# EAGLE design hev-controller 1.1 (EAGLE 6.2)
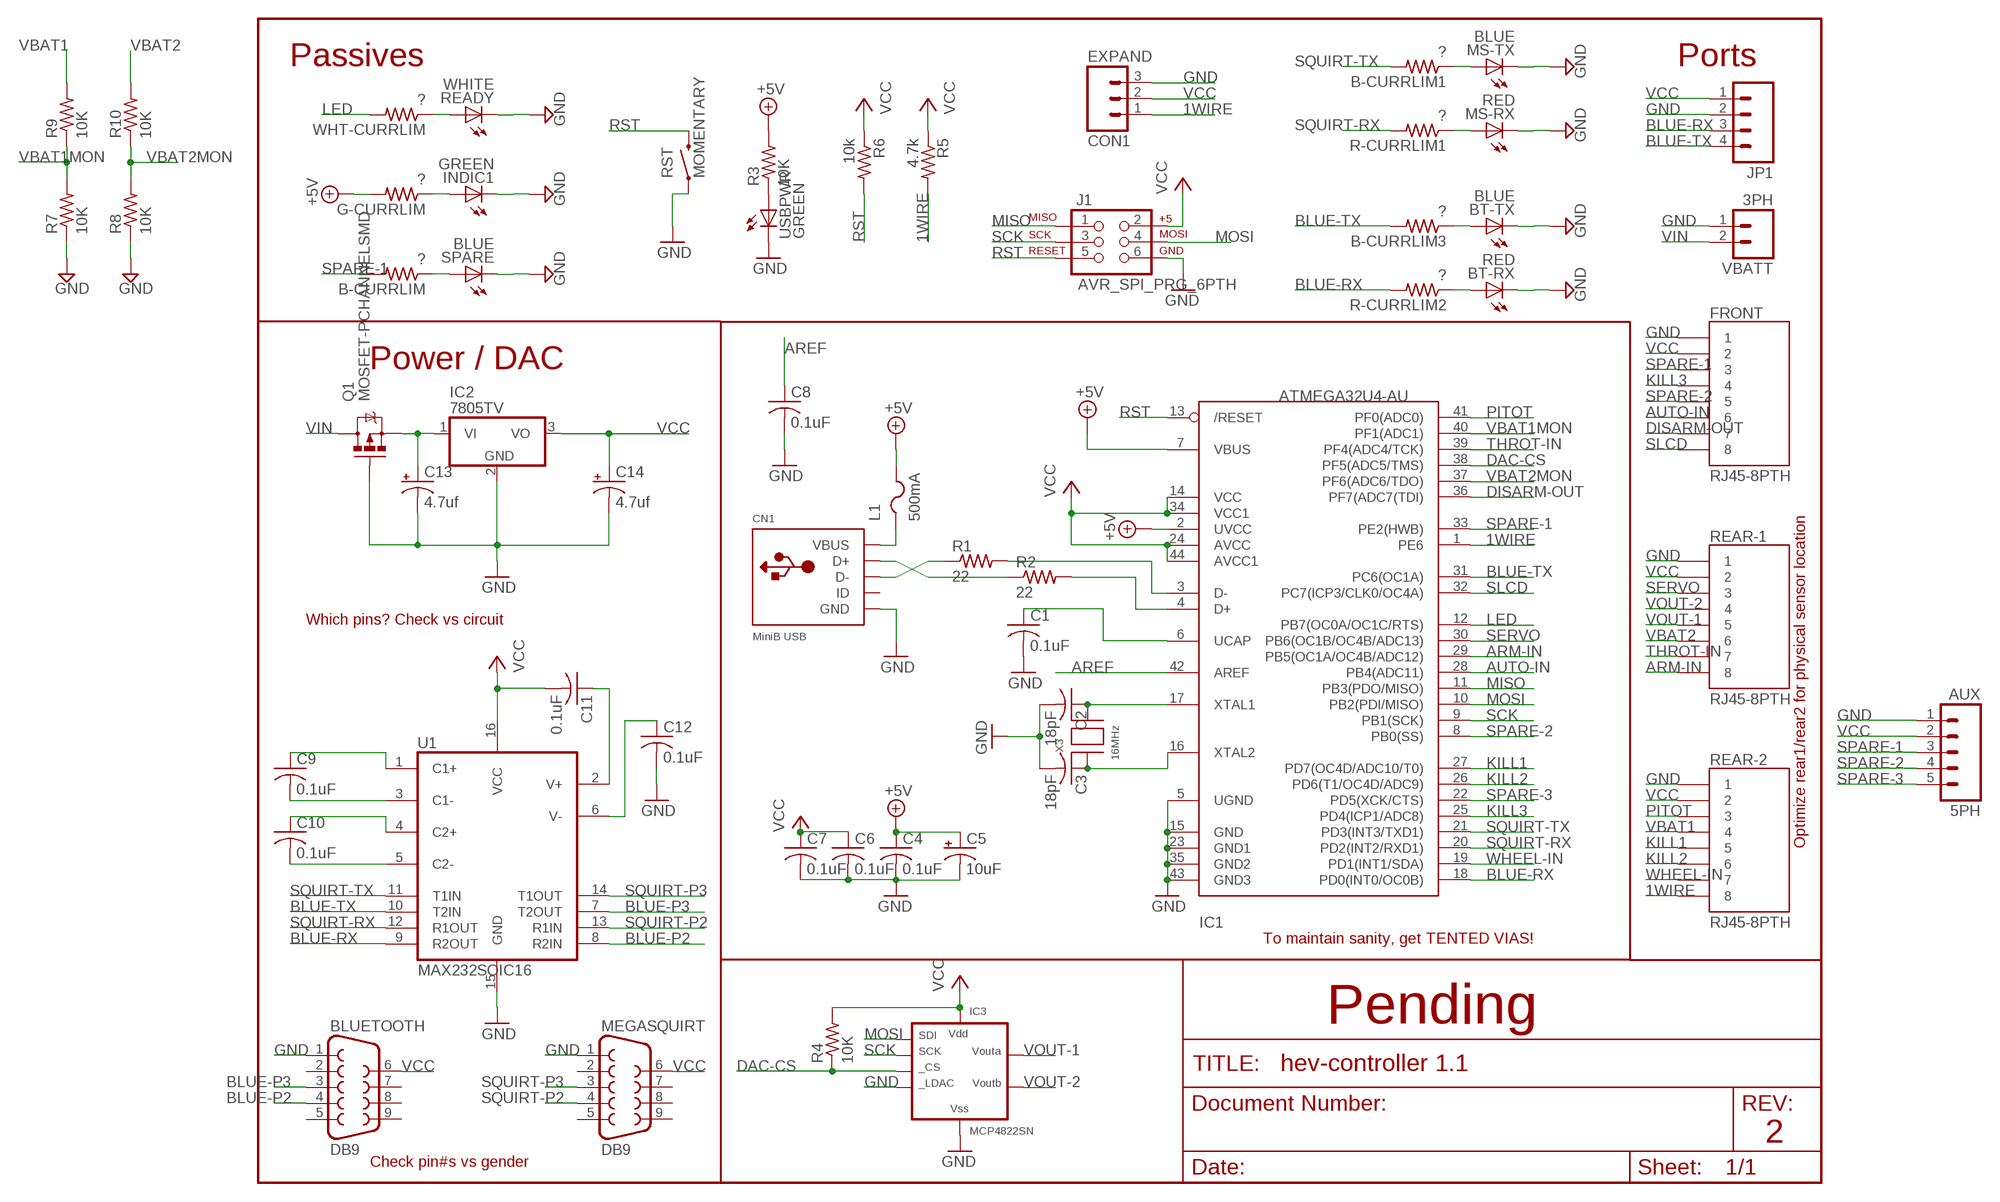
[diagram p0: schematic, sheet 1]

## Parts
5PH  AUX  M05PTH  [1X05]
B-CURRLIM  ?  R-US_R0805  [R0805]
B-CURRLIM1  ?  R-US_R0805  [R0805]
B-CURRLIM3  ?  R-US_R0805  [R0805]
BLUETOOTH  DB9  [DB9]
BT-RX  RED  LEDCHIPLED_0805  [CHIPLED_0805]
BT-TX  BLUE  LEDCHIPLED_0805  [CHIPLED_0805]
C1  0.1uF  C-USC0805K  [C0805K]
C2  18pF  C-USC0805K  [C0805K]
C3  18pF  C-USC0805K  [C0805K]
C4  0.1uF  C-USC0805K  [C0805K]
C5  10uF  CPOL-USA/3216-18R  [A/3216-18R]
C6  0.1uF  C-USC0805K  [C0805K]
C7  0.1uF  C-USC0805K  [C0805K]
C8  0.1uF  C-USC0805K  [C0805K]
C9  0.1uF  C-USC0805K  [C0805K]
C10  0.1uF  C-USC0805K  [C0805K]
C11  0.1uF  C-USC0805K  [C0805K]
C12  0.1uF  C-USC0805K  [C0805K]
C13  4.7uf  CPOL-USE2.5-6  [E2,5-6]
C14  4.7uf  CPOL-USE2.5-6  [E2,5-6]
CN1  MiniB USB  USBMINIB  [USB-MINIB]
EXPAND  CON1  M03POLAR  [MOLEX-1X3]
FRONT  RJ45-8PTH  [RJ45-8]
G-CURRLIM  ?  R-US_R0805  [R0805]
IC1  ATMEGA32U4-AU  [TQFP44]
IC2  7805TV  [TO220V]
IC3  MCP4822SN  [SO-08]
INDIC1  GREEN  LEDCHIPLED_0805  [CHIPLED_0805]
J1  AVR_SPI_PRG_6PTH  [2X3]
JP1  M04PTH  [1X04]
L1  500mA  PTCFUSE-1206  [R1206]
MEGASQUIRT  DB9  [DB9]
MS-RX  RED  LEDCHIPLED_0805  [CHIPLED_0805]
MS-TX  BLUE  LEDCHIPLED_0805  [CHIPLED_0805]
Q1  MOSFET-PCHANNELSMD  [SOT23-3]
R1  22  R-US_R0805  [R0805]
R2  22  R-US_R0805  [R0805]
R3  10K  R-US_R0805  [R0805]
R4  10K  R-US_R0805  [R0805]
R5  4.7k  R-US_R0805  [R0805]
R6  10k  R-US_R0805  [R0805]
R7  10K  R-US_R0805  [R0805]
R8  10K  R-US_R0805  [R0805]
R9  10K  R-US_R0805  [R0805]
R10  10K  R-US_R0805  [R0805]
R-CURRLIM1  ?  R-US_R0805  [R0805]
R-CURRLIM2  ?  R-US_R0805  [R0805]
READY  WHITE  LED1206  [LED-1206]
REAR-1  RJ45-8PTH  [RJ45-8]
REAR-2  RJ45-8PTH  [RJ45-8]
RST  MOMENTARY  SWITCH-MOMENTARY-2-SMD-1101NE  [TACTILE-SWITCH-1101NE]
SPARE  BLUE  LEDCHIPLED_0805  [CHIPLED_0805]
U1  MAX232SOIC16  [SO016]
USBPWR  GREEN  LEDCHIPLED_0805  [CHIPLED_0805]
VBATT  3PH  M023.5MM  [SCREWTERMINAL-3.5MM-2]
WHT-CURRLIM  ?  R-US_R0805  [R0805]
X3  16MHz  XTALNX5032  [NX5032]

## Nets
1WIRE: EXPAND.1 IC1.1(PE6) R5.2 REAR-2.8
+5V: C4.1 C5.+ G-CURRLIM.2 IC1.2(UVCC) IC1.7(VBUS) L1.2 R3.2
AREF: C8.1 IC1.42(AREF)
ARM-IN: IC1.29(PB5(OC1A/OC4B/ADC12)) REAR-1.8
AUTO-IN: FRONT.6 IC1.28(PB4(ADC11))
BLUE-P2: BLUETOOTH.4 U1.8(R2IN)
BLUE-P3: BLUETOOTH.3 U1.7(T2OUT)
BLUE-RX: IC1.18(PD0(INT0/OC0B)) JP1.3 R-CURRLIM2.2 U1.9(R2OUT)
BLUE-TX: B-CURRLIM3.2 IC1.31(PC6(OC1A)) JP1.4 U1.10(T2IN)
DAC-CS: IC1.38(PF5(ADC5/TMS)) IC3.2(CS) R4.1
DISARM-OUT: FRONT.7 IC1.36(PF7(ADC7(TDI))
GND [gnd]: 5PH.1 BLUETOOTH.1 BT-RX.C BT-TX.C C1.2 C2.2 C3.2 C4.2 C5.- C6.2 C7.2 C8.2 C12.2 C13.- C14.- CN1.GND EXPAND.3 FRONT.1 IC1.5(UGND) IC1.15(GND) IC1.23(GND1) IC1.35(GND2) IC1.43(GND3) IC2.2(GND) IC3.5(LDAC) IC3.7(VSS) INDIC1.C J1.6 JP1.2 MEGASQUIRT.1 MS-RX.C MS-TX.C Q1.1(G) R7.1 R8.1 READY.C REAR-1.1 REAR-2.1 RST.P$1 SPARE.C U1.15(GND) USBPWR.C VBATT.1
KILL1: IC1.27(PD7(OC4D/ADC10/T0)) REAR-2.5
KILL2: IC1.26(PD6(T1/OC4D/ADC9)) REAR-2.6
KILL3: FRONT.4 IC1.25(PD4(ICP1/ADC8))
LED: IC1.12(PB7(OC0A/OC1C/RTS)) WHT-CURRLIM.2
MISO: IC1.11(PB3(PDO/MISO)) J1.1
MOSI: IC1.10(PB2(PDI/MISO)) IC3.4(SDI) J1.4
N$1: R3.1 USBPWR.A
N$2: CN1.D+ R2.1
N$3: IC1.3(D-) R1.2
N$4: IC1.4(D+) R2.2
N$5: CN1.D- R1.1
N$6: B-CURRLIM.1 SPARE.A
N$7: G-CURRLIM.1 INDIC1.A
N$8: C2.1 IC1.17(XTAL1) X3.P$2
N$9: C3.1 IC1.16(XTAL2) X3.P$1
N$10: B-CURRLIM1.1 MS-TX.A
N$11: MS-RX.A R-CURRLIM1.1
N$12: B-CURRLIM3.1 BT-TX.A
N$13: BT-RX.A R-CURRLIM2.1
N$14: C13.+ IC2.1(VI) Q1.2(S)
N$25: READY.A WHT-CURRLIM.1
N$48: C9.1 U1.1(C1+)
N$49: C9.2 U1.3(C1-)
N$50: C10.1 U1.4(C2+)
N$51: C10.2 U1.5(C2-)
N$52: C11.1 U1.2(V+)
N$53: C12.1 U1.6(V-)
PITOT: IC1.41(PF0(ADC0)) REAR-2.3
RST: IC1.13(/RESET) J1.5 R6.2 RST.P$2
SCK: IC1.9(PB1(SCK)) IC3.3(SCK) J1.3
SERVO: IC1.30(PB6(OC1B/OC4B/ADC13)) REAR-1.3
SLCD: FRONT.8 IC1.32(PC7(ICP3/CLK0/OC4A))
SPARE-1: 5PH.3 B-CURRLIM.2 FRONT.3 IC1.33(PE2(HWB))
SPARE-2: 5PH.4 FRONT.5 IC1.8(PB0(SS))
SPARE-3: 5PH.5 IC1.22(PD5(XCK/CTS))
SQUIRT-P2: MEGASQUIRT.4 U1.13(R1IN)
SQUIRT-P3: MEGASQUIRT.3 U1.14(T1OUT)
SQUIRT-RX: IC1.20(PD2(INT2/RXD1)) R-CURRLIM1.2 U1.12(R1OUT)
SQUIRT-TX: B-CURRLIM1.2 IC1.21(PD3(INT3/TXD1)) U1.11(T1IN)
THROT-IN: IC1.39(PF4(ADC4/TCK)) REAR-1.7
UCAP: C1.1 IC1.6(UCAP)
VBAT1: R9.2 REAR-2.4
VBAT1MON: IC1.40(PF1(ADC1)) R7.2 R9.1
VBAT2: R10.2 REAR-1.6
VBAT2MON: IC1.37(PF6(ADC6/TDO)) R8.2 R10.1
VBUS: CN1.VBUS L1.1
VCC [power]: 5PH.2 BLUETOOTH.6 C6.1 C7.1 C11.2 C14.+ EXPAND.2 FRONT.2 IC1.14(VCC) IC1.24(AVCC) IC1.34(VCC1) IC1.44(AVCC1) IC2.3(VO) IC3.1(VDD) J1.2 JP1.1 MEGASQUIRT.6 R4.2 R5.1 R6.1 REAR-1.2 REAR-2.2 U1.16(VCC)
VIN [power]: Q1.3(D) VBATT.2
VOUT-1: IC3.8(VOUTA) REAR-1.5
VOUT-2: IC3.6(VOUTB) REAR-1.4
WHEEL-IN: IC1.19(PD1(INT1/SDA)) REAR-2.7
Unconnected: BLUETOOTH.2 BLUETOOTH.5 BLUETOOTH.7 BLUETOOTH.8 BLUETOOTH.9 CN1.ID MEGASQUIRT.2 MEGASQUIRT.5 MEGASQUIRT.7 MEGASQUIRT.8 MEGASQUIRT.9

## Notes on the sheet
- Passives | Ports
- Power / DAC
- Which pins? Check vs circuit
- Optimize rear1/rear2 for physical sensor location
- To maintain sanity, get TENTED VIAS!
- Pending
- 2
- Check pin#s vs gender

## Library data of the parts
5PH = SparkFun:M05: Header 5 Standard 5-pin 0.1" header. Use with straight break away headers (SKU : PRT-00116), right angle break away headers (PRT-00553), swiss pins (PRT-00743), machine pins (PRT-00117), and female headers (PRT-00115). Molex polarized connector foot print use with SKU : PRT-08230 with associated crimp pins and housings.
B-CURRLIM B-CURRLIM1 B-CURRLIM3 G-CURRLIM R1-R10 R-CURRLIM1 R-CURRLIM2 WHT-CURRLIM = adafruit:R-US_: RESISTOR, American symbol
BLUETOOTH MEGASQUIRT = SparkFun:DB9: DB9 Connector Standard DB9 (D-Sub 9) serial connector. Can be used for CAN bus as well as RS485 and RS232. Footprint production proven. Spark Fun Electronics SKU : PRT-00429
BT-RX BT-TX INDIC1 MS-RX MS-TX SPARE USBPWR = adafruit:LED: LED OSRAM: - CHIPLED LG R971, LG N971, LY N971, LG Q971, LY Q971, LO R971, LY R971 LH N974, LH R974 LS Q976, LO Q976, LY Q976 LO Q996 - Hyper CHIPLED LW Q18S LB Q993, LB Q99A, LB R99A - SideLED LS A670, LO A670, LY A670, LG A670, LP A670 LB A673, LV A673, LT A673, LW A673 LH A674 LY A675 LS A676, LA A676, LO A676, LY A676, LW A676 LS A679, LY A679, LG A679 - Hyper Micro SIDELED® LS Y876, LA Y876, LO Y876, LY Y876 LT Y87S - SmartLED LW L88C, LW L88S LB L89C, LB L89S, LG L890 LS L89K, LO L89K, LY L89K LS L896, LA L896, LO L896, LY L896 - TOPLED LS T670, LO T670, LY T670, LG T670, LP T670 LSG T670, LSP T670, LSY T670, LOP T670, LYG T670 LG T671, LOG T671, LSG T671 LB T673, LV T673, LT T673, LW T673 LH T674 LS T676, LA T676, LO T676, LY T676, LB T676, LH T676, LSB T676, LW T676 LB T67C, LV T67C, LT T67C, LS T67K, LO T67K, LY T67K, LW E67C LS E67B, LA E67B, LO E67B, LY E67B, LB E67C, LV E67C, LT E67C LW T67C LS T679, LY T679, LG T679 LS T770, LO T770, LY T770, LG T770, LP T770 LB T773, LV T773, LT T773, LW T773 LH T774 LS E675, LA E675, LY E675, LS T675 LS T776, LA T776, LO T776, LY T776, LB T776 LHGB T686 LT T68C, LB T68C - Hyper Mini TOPLED® LB M676 - Mini TOPLED Santana® LG M470 LS M47K, LO M47K, LY M47K Source: http://www.osram.convergy.de/
C1-C4 C6-C12 = adafruit:C-US: CAPACITOR, American symbol
C5 = adafruit:CPOL-US: POLARIZED CAPACITOR, American symbol
C13 C14 = rcl:CPOL-US: POLARIZED CAPACITOR, American symbol
CN1 = adafruit:USB: USB Connectors USBMINIB - Surface Mount Female Mini-B USB Connector 4UConnector: 06564 By microbuilder.eu Thru-hole RA Female Mini-B USB Connector 4UConnector: 18732 By ladyada.net
EXPAND = SparkFun:M03: Header 3 Standard 3-pin 0.1" header. Use with straight break away headers (SKU : PRT-00116), right angle break away headers (PRT-00553), swiss pins (PRT-00743), machine pins (PRT-00117), and female headers (PRT-00115). Molex polarized connector foot print use with SKU : PRT-08232 with associated crimp pins and housings.
FRONT REAR-1 REAR-2 = SparkFun:RJ45-8: RJ45 Jack Simple RJ45, 8-pin connection - connector for common Cat5, Cat5e, and Cat6 Ethernet cables. Footprint not yet proven in production. Connector sku is PRT-00643; Breakout PCB sku is BOB-00716.
IC1 = adaprog:ATMEGA32U4
IC2 = linear:78*: Positive VOLTAGE REGULATOR Source: http://cache.national.com/ds/LM/LM78L05.pdf http://www.fairchildsemi.com/ds/LM/LM7805.pdf
IC3 = microchip-dac:MCP4822: MCP4822: 12-bit dual DAC MCP4802/4812/4822 - 8/10/12-Bit Dual Voltage Output Digital-to-Analog Converter with Internal VREF and SPI Interface The MCP48x2 devices are dual 8-bit, 10-bit and 12-bit buffered voltage output Digital-to-Analog Converters (DACs), respectively. The devices operate from a single 2.7V to 5.5V supply with SPI compatible Serial Peripheral Interface. The devices have a high precision internal voltage reference (VREF = 2.048V). The user can configure the full-scale range of the device to be 2.048V or 4.096V by setting the Gain Selection Option bit (gain of 1 of 2). RobG
J1 = SparkFun:AVR_SPI_PRG_6: AVR ISP 6 Pin This is the reduced ISP connector for AVR programming. Common on Arduino. This footprint will take up less PCB space and can be used with a 10-pin to 6-pin adapter such as SKU: BOB-08508
JP1 = SparkFun-Connectors:M04: Header 4 Standard 4-pin 0.1" header. Use with straight break away headers (SKU : PRT-00116), right angle break away headers (PRT-00553), swiss pins (PRT-00743), machine pins (PRT-00117), and female headers (PRT-00115). Molex polarized connector foot print use with SKU : PRT-08231 with associated crimp pins and housings. 1MM SMD Version SKU: PRT-10208
L1 = adafruit:PTCFUSE: PTC fuses, resettable thermistors
Q1 = SparkFun-DiscreteSemi:MOSFET-PCHANNEL: Generic PMOSFET
READY = SparkFun:LED: LEDs Standard schematic elements and footprints for 5mm, 3mm, 1206, and 0603 sized LEDs. 5mm - Spark Fun Electronics SKU : COM-00529 (and others)
RST = SparkFun:SWITCH-MOMENTARY-2
U1 = SparkFun:MAX232: RS232 Transceiver Very common IC. This is generically called 'MAX232', but works with the 3V equivalent MAX3232 generic ICs. Field tested and mother approved. Spark Fun Electronics SKU : COM-00316 (DIP) and COM-00589 (SMD)
VBATT = SparkFun:M02: Header 2 Standard 2-pin 0.1" header. Use with straight break away headers (SKU : PRT-00116), right angle break away headers (PRT-00553), swiss pins (PRT-00743), machine pins (PRT-00117), and female headers (PRT-00115). Molex polarized connector foot print use with SKU : PRT-08233 with associated crimp pins and housings.
X3 = adaprog:XTAL

## Net classes
0 default: width 0.254 mm
1 power: width 0.508 mm
2 gnd: width 0.508 mm

## Board
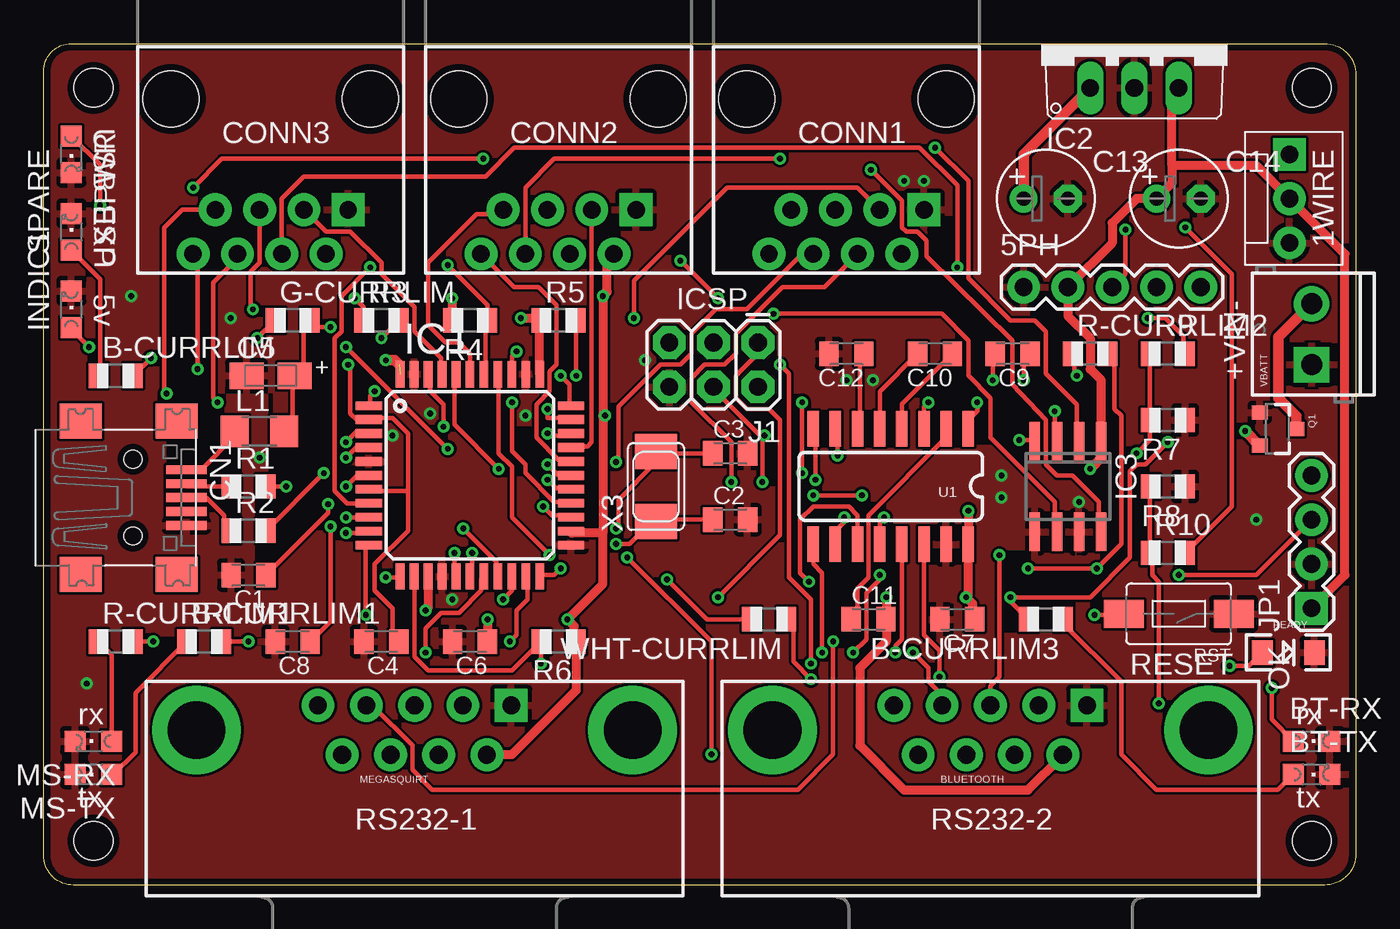
[diagram p1: board, top side]
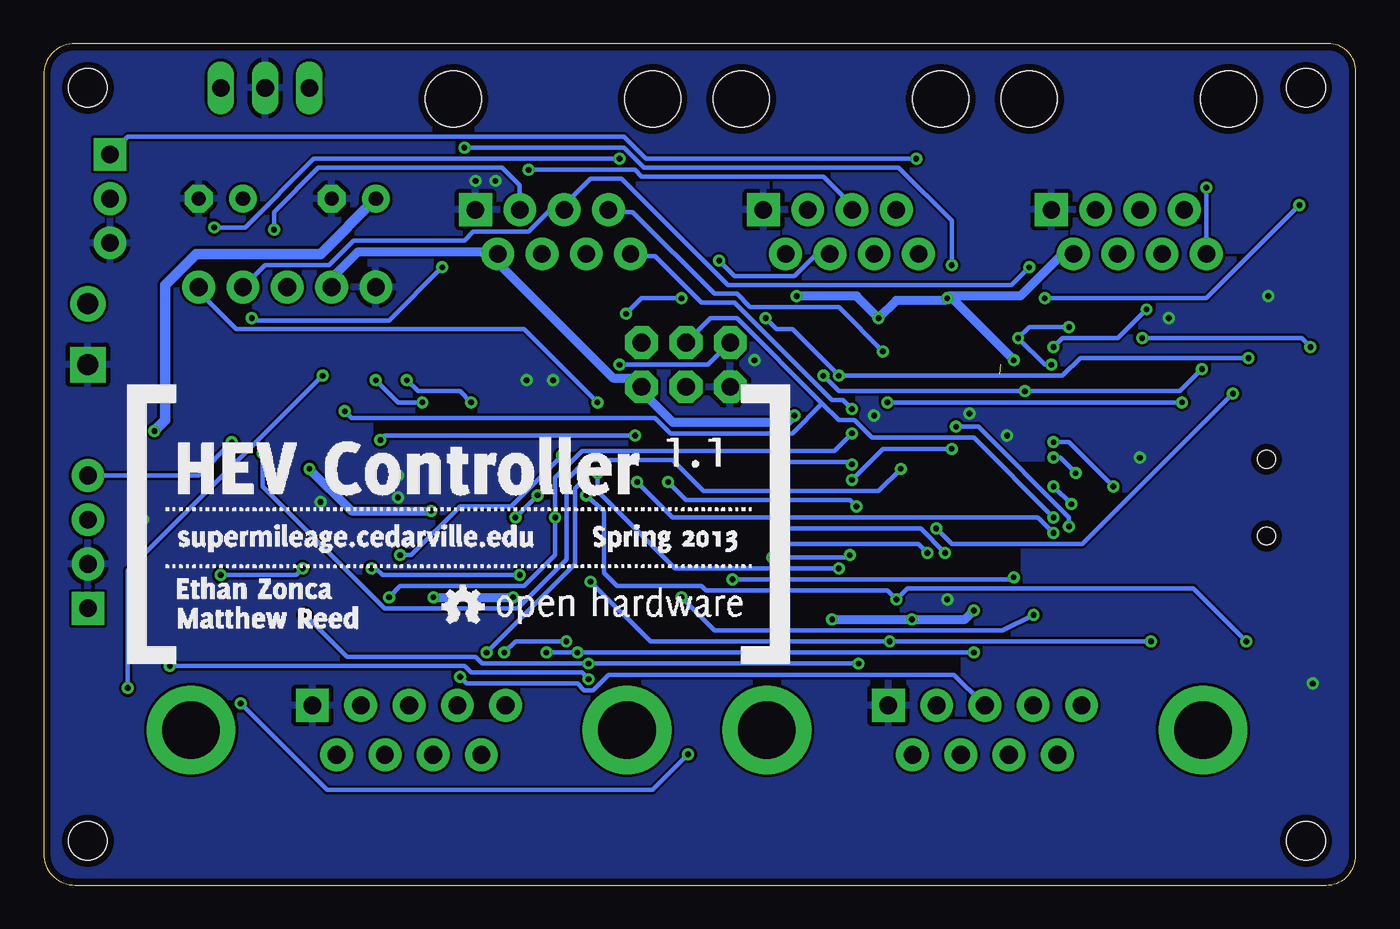
[diagram p2: board, bottom side, seen from below]

Size 75.25 x 48.26 mm. Coordinates in mm from the lower left corner, seen from the top.
Outline: 75.25,46.46 75.25,1.8 arc-90 73.45,0 1.71,0 arc-90 0,1.71 0,46.67 arc-90 1.59,48.26 73.45,48.26 arc-90 75.25,46.46
Copper layers (1*16): Top 0.0356mm / dielectric 1.5011mm / Bottom 0.0356mm
Design rules "default": minimum track width 6mil, minimum drill 13mil, track to track 6mil, track to pad 6mil, pad to pad 6mil, via to via 6mil, smd to smd 6mil, copper to edge 15mil, drill to drill 6mil, minimum pad ring 7mil, minimum via ring 7mil, stop-mask expansion 4mil, vias tented up to drill 15mil, thermal gap 10mil
Holes 2.2 mm at 2.86,45.72 72.71,45.72 72.71,2.54 2.86,2.54
tRestrict: area 4.5,23.7 to 5.8,25; area 4.5,19.4 to 5.8,20.7; area 5.5,43.3 to 9.1,46.9; area 17,43.3 to 20.5,46.9; area 22,43.3 to 25.6,46.9; area 33.5,43.3 to 37,46.9; area 38.5,43.3 to 42.1,46.9; area 50,43.3 to 53.5,46.9; area 6.7,14.1 to 7.6,14.2; area 12.1,18.7 to 12.3,19.6; area 12.1,21.2 to 12.4,22; area 11.2,21.2 to 11.4,22.1; 20 more areas
bRestrict: area 5.5,43.3 to 9.1,46.9; area 17,43.3 to 20.5,46.9; area 22,43.3 to 25.6,46.9; area 33.5,43.3 to 37,46.9; area 38.5,43.3 to 42.1,46.9; area 50,43.3 to 53.5,46.9; area 4.5,23.7 to 5.8,25; area 4.5,19.4 to 5.8,20.7; area 18.1,24.1 to 18.9,24.3; area 17.7,24.1 to 18.1,24.3; area 18.7,24.1 to 19.1,24.3; area 19.2,19.1 to 19.4,19.3; 11 more areas

### Footprints (pad centres in the part's own frame; a part is rotated, then mirrored left to right if it is on the bottom)
1X05 = drill 1.016 pad 1.88: 1 0,0; 2 2.54,0; 3 5.08,0; 4 7.62,0; 5 10.16,0
R0805 = smd 1.1 x 1.4: 1 -1,0; 2 1,0
DB9 = drill 1.016 pad 1.88 square: 1 -5.54,-1.42 | drill 1.016 pad 1.88: 2 -2.77,-1.42; 3 0,-1.42; 4 2.77,-1.42; 5 5.54,-1.42; 6 -4.15,1.42; 7 -1.38,1.42; 8 1.38,1.42; 9 4.15,1.42 | drill 3.302 pad 5.08: G1 -12.5,0; G2 12.5,0
CHIPLED_0805 = smd 1.2 x 1.2: A 0,-1.05; C 0,1.05
C0805K = smd 1.1 x 1.4: 1 -1,0; 2 1,0
A/3216-18R = smd 1.95 x 1.5: + 1.375,0; - -1.375,0
E2,5-6 = drill 0.813 pad 1.6: + -1.27,0 | drill 0.813 pad 1.6 octagon: - 1.27,0
USB-MINIB = smd 0.5 x 2.308: D+ 0,4.064; D- -0.8,4.064; GND 1.6,4.064; ID 0.8,4.064; VBUS -1.6,4.064 | smd 2 x 2.4: GND1 -4.4,-2; GND2 -4.4,3.5; GND3 4.4,3.5; GND4 4.4,-2 | hole 1: -2.2,1; 2.2,1
MOLEX-1X3 = drill 1.016 pad 1.88 square: 1 0,0 | drill 1.016 pad 1.88: 2 2.54,0; 3 5.08,0
RJ45-8 = drill 1 pad 1.88 square: 1 -4.445,6.35 | drill 1 pad 1.88: 2 -3.175,8.89; 3 -1.905,6.35; 4 -0.635,8.89; 5 0.635,6.35; 6 1.905,8.89; 7 3.175,6.35; 8 4.445,8.89 | hole 3.2: -5.715,0; 5.715,0
TQFP44 = smd 1.5 x 0.5: 1 -5.8,4; 2 -5.8,3.2; 3 -5.8,2.4; 4 -5.8,1.6; 5 -5.8,0.8; 6 -5.8,0; 7 -5.8,-0.8; 8 -5.8,-1.6; 9 -5.8,-2.4; 10 -5.8,-3.2; 11 -5.8,-4; 23 5.8,-4; 24 5.8,-3.2; 25 5.8,-2.4; 26 5.8,-1.6; 27 5.8,-0.8; 28 5.8,0; 29 5.8,0.8; 30 5.8,1.6; 31 5.8,2.4; 32 5.8,3.2; 33 5.8,4 | smd 0.5 x 1.5: 12 -4,-5.8; 13 -3.2,-5.8; 14 -2.4,-5.8; 15 -1.6,-5.8; 16 -0.8,-5.8; 17 0,-5.8; 18 0.8,-5.8; 19 1.6,-5.8; 20 2.4,-5.8; 21 3.2,-5.8; 22 4,-5.8; 34 4,5.8; 35 3.2,5.8; 36 2.4,5.8; 37 1.6,5.8; 38 0.8,5.8; 39 0,5.8; 40 -0.8,5.8; 41 -1.6,5.8; 42 -2.4,5.8; 43 -3.2,5.8; 44 -4,5.8
TO220V = drill 1.016 long: 1 -2.54,-2.54; 2 0,-2.54; 3 2.54,-2.54
SO-08 = smd 0.6 x 2.2: 1 -1.905,-2.6; 2 -0.635,-2.6; 3 0.635,-2.6; 4 1.905,-2.6; 5 1.905,2.6; 6 0.635,2.6; 7 -0.635,2.6; 8 -1.905,2.6
2X3 = drill 1.016 pad 1.88 octagon: 1 0,0; 2 0,2.54; 3 2.54,0; 4 2.54,2.54; 5 5.08,0; 6 5.08,2.54
1X04 = drill 1.016 pad 1.88 square: 1 0,0 | drill 1.016 pad 1.88: 2 2.54,0; 3 5.08,0; 4 7.62,0
R1206 = smd 1.6 x 1.803: 1 -1.422,0; 2 1.422,0
SOT23-3 = smd 0.8 x 0.9: 1 -0.95,-1; 2 0.95,-1; 3 0,1.1
LED-1206 = smd 1.2 x 1.4: A -1.5,0; C 1.5,0
TACTILE-SWITCH-1101NE = smd 2.3 x 1.6: P$1 -3.15,0; P$2 3.15,0
SO016 = smd 0.66 x 2.032: 1 -4.445,-3.315; 2 -3.175,-3.315; 3 -1.905,-3.315; 4 -0.635,-3.315; 5 0.635,-3.315; 6 1.905,-3.315; 7 3.175,-3.315; 8 4.445,-3.315; 9 4.445,3.315; 10 3.175,3.315; 11 1.905,3.315; 12 0.635,3.315; 13 -0.635,3.315; 14 -1.905,3.315; 15 -3.175,3.315; 16 -4.445,3.315
SCREWTERMINAL-3.5MM-2 = drill 1.2 pad 2.032 square: 1 0,0 | drill 1.2 pad 2.032: 2 3.5,0
NX5032 = smd 2 x 2.4: P$1 2,0; P$2 -2,0

### Placement (x,y rotation side)
5PH  56.2,34.29 0 top
B-CURRLIM  4.13,29.21 0 top
B-CURRLIM1  9.21,13.97 0 top
B-CURRLIM3  57.47,15.24 180 top
BLUETOOTH  54.29,8.89 180 top
BT-RX  72.71,8.25 270 top
BT-TX  72.71,6.35 270 top
C1  11.75,17.78 180 top
C2  39.37,20.95 0 top
C3  39.37,24.76 0 top
C4  19.37,13.97 180 top
C5  13.02,29.21 0 top
C6  24.45,13.97 180 top
C7  52.39,15.24 180 top
C8  14.29,13.97 180 top
C9  55.56,30.48 180 top
C10  51.12,30.48 180 top
C11  47.31,15.24 0 top
C12  46.04,30.48 180 top
C13  57.47,39.37 0 top
C14  65.09,39.37 0 top
CN1  4.13,22.22 270 top
EXPAND  71.44,41.91 270 top
FRONT  46.04,45.08 180 top
G-CURRLIM  14.29,32.39 0 top
IC1  24.45,23.5 0 top
IC2  62.55,48.26 0 top
IC3  58.74,22.86 180 top
INDIC1  1.59,33.02 0 top
J1  40.96,31.11 180 top
JP1  72.71,15.88 90 top
L1  12.38,26.04 0 top
MEGASQUIRT  21.27,8.89 180 top
MS-RX  2.86,8.25 90 top
MS-TX  2.86,6.35 90 top
Q1  70.74,26.16 270 top
R1  11.75,22.86 0 top
R2  11.75,20.32 0 top
R3  19.37,32.39 0 top
R4  24.45,32.39 180 top
R5  29.53,32.39 0 top
R6  29.53,13.97 180 top
R7  64.45,26.67 180 top
R8  64.45,22.86 180 top
R9  64.45,30.48 0 top
R10  64.45,19.05 0 top
R-CURRLIM1  4.13,13.97 0 top
R-CURRLIM2  60.01,30.48 0 top
READY  71.37,13.34 0 top
REAR-1  29.53,45.08 180 top
REAR-2  13.02,45.08 180 top
RST  65.09,15.56 180 top
SPARE  1.59,37.47 0 top
U1  48.58,22.86 180 top
U$2  [SUPERMILEAGE-SILK-V1.1]  70.42,12.7 0 bottom
USBPWR  1.59,41.91 180 top
VBATT  72.71,29.85 90 top
WHT-CURRLIM  41.59,15.24 180 top
X3  35.12,22.86 90 top

### Tracks (layer width: path | path; a pad name or v marks a point on that pad's centre or on a via)
1WIRE  (via drill 0.33)
  Top 0.254: v30.54,29.21 30.54,32.39 R5.2 | v18.99,28.32 18.73,28.07 18.73,27.56 IC1.1 | REAR-2.8 8.83,35.94 v8.83,29.59 | v8.57,40 10.22,41.66 v25.21,41.66
  Bottom 0.254: v30.54,29.21 29.65,28.32 v18.99,28.32 10.1,28.32 v8.83,29.59 | EXPAND.1 70.42,42.93 41.97,42.93 40.7,41.66 v25.21,41.66 | v8.57,40 REAR-2.8
+5V  (via drill 0.33)
  Top 0.254: 14.92,32 14.92,29.72 14.41,29.21 C5.+ 14.29,29.21 14.29,26.42 13.91,26.04 L1.2 | 14.92,32 14.92,32.13 15.18,32.39 G-CURRLIM.2 14.92,32 | 14.92,32 v16.45,32 | 20.26,32.39 R3.2 19.37,31.39 v19.37,31.37 | C4.1 20.26,13.97 20,14.22 20,15.88 18.99,16.89 18.99,18.41 20.89,20.32 20.89,22.61 | IC1.7 18.73,22.61 20.89,22.61 | 20.89,22.61 20.89,25.91 20,26.8 18.73,26.8 IC1.2 18.61,26.67 17.97,26.67 17.59,27.05 17.59,29.72 v17.46,29.85
  Bottom 0.254: v16.45,32 18.73,32 v19.37,31.37 17.84,29.85 v17.46,29.85
AREF  (via drill 0.33)
  Top 0.254: v16.45,20.57 16.45,15.11 15.3,13.97 C8.1 | IC1.42 22.16,29.21 22.16,28.32 22.92,27.56 v22.92,26.29
  Bottom 0.254: v16.45,20.57 16.45,21.08 21.65,26.29 v22.92,26.29
ARM-IN
  Top 0.254: IC1.29 30.16,24.38 29.53,24.38 28.26,25.65 28.26,27.56 29.02,28.32 29.02,29.46 29.4,29.85 29.4,33.27 28.38,34.29 26.99,34.29 REAR-1.8
AUTO-IN  (via drill 0.33)
  Top 0.254: v32.83,24.26 32.96,24.38 32.96,27.43 35.37,29.85 36.51,29.85 37.15,30.48 37.15,31.62 38.54,33.02 40.32,33.02 43.5,36.19 FRONT.6 | v28.89,24.13 29.53,23.5 IC1.28
  Bottom 0.254: v28.89,24.13 29.02,24.26 v32.83,24.26
BLUE-P2  (via drill 0.33)
  Top 0.254: v44.26,23.24 44.26,26.04 U1.8 | v49.85,13.34 50.74,12.45 50.74,11.68 51.5,10.92 51.5,10.41 BLUETOOTH.4
  Bottom 0.254: v49.85,13.34 44.77,18.41 44.77,22.73 v44.26,23.24
BLUE-P3  (via drill 0.33)
  Top 0.254: v45.53,24.64 45.53,26.04 U1.7 | v54.8,18.92 54.8,11.94 54.29,11.43 BLUETOOTH.3
  Bottom 0.254: v45.53,24.64 48.45,21.72 51.37,21.72 54.17,18.92 v54.8,18.92
BLUE-RX  (via drill 0.33)
  Top 0.254: R-CURRLIM2.2 61.02,30.48 61.4,30.1 61.4,27.31 61.79,26.92 61.79,19.56 v60.39,18.16 v56.45,18.16 | IC1.18 25.21,17.65 25.08,17.53 25.08,16.89 23.81,15.62 22.8,15.62 21.91,14.73 v21.91,13.34 | JP1.3 69.53,17.78 v65.09,17.78 | v44.64,13.34 44.64,17.91 44.13,18.41 U1.9 | v47.94,17.78 47.94,17.53 47.18,16.76 47.18,14.1 v46.42,13.34
  Bottom 0.254: v21.91,13.34 v44.64,13.34 v46.42,13.34 | v65.09,17.78 60.77,17.78 v60.39,18.16 | v56.45,18.16 56.2,18.16 55.82,17.78 v47.94,17.78
BLUE-TX  (via drill 0.33)
  Top 0.254: B-CURRLIM3.2 56.45,15.24 55.44,16.26 v55.44,16.51 60.01,16.51 62.29,18.8 62.29,23.75 62.67,24.13 63.18,24.13 v64.45,25.4 | v28.89,25.91 28.89,25.78 30.16,25.78 IC1.31 | U1.10 45.4,20.32 45.91,20.83 v45.91,21.08
  Bottom 0.254: v55.44,16.51 54.8,17.14 47.69,17.14 45.91,18.92 v45.91,21.08 45.91,23.37 44.39,24.89 29.91,24.89 v28.89,25.91 | JP1.4 66.36,23.5 v64.45,25.4
DAC-CS  (via drill 0.33)
  Top 0.254: IC1.38 25.34,29.34 25.34,32.39 R4.1 25.46,32.39 25.46,33.27 v23.18,35.56 | v51.12,42.29 53.02,40.39 53.02,34.8 55.44,32.39 56.83,32.39 57.47,31.75 57.47,29.34 59.25,27.56 59.25,25.65 59.37,25.53 IC3.2
  Bottom 0.254: v51.12,42.29 41.97,42.29 40.83,41.15 26.23,41.15 23.18,38.1 v23.18,35.56
DISARM-OUT  (via drill 0.33)
  Top 0.254: IC1.36 26.86,29.34 26.86,30.35 v27.11,30.61
  Bottom 0.254: v27.11,30.61 29.65,33.15 34.73,33.15 35.5,33.91 36.77,33.91 41.47,38.61 42.74,38.61 FRONT.7
GND  (via drill 0.33)
  other vias: 23.43,16.38 34.48,30.1 49.34,40.39 50.48,40.39 46.04,28.96 47.56,28.96 59.37,21.97 54.93,22.22 54.93,23.5 20,25.78 22.16,27.05 27.62,26.92 69.53,20.95 10.73,32.51 5.02,33.78 2.48,11.56 12.38,24.51
  pour Bottom: -2.22,49.21 -2.22,-1.27 76.52,-1.27 76.52,49.21
  pour Top: -3.81,49.53 -3.81,-1.27 76.83,-1.27 76.83,49.53
KILL1  (via drill 0.33)
  Top 0.254: v28.89,23.24 29.4,22.73 30.16,22.73 IC1.27 | v17.34,30.86 v23.18,25.02 | v12,33.02 11.87,33.15 11.87,35.18 12.38,35.69 REAR-2.5
  Bottom 0.254: v28.89,23.24 27.11,25.02 v23.18,25.02 | v17.34,30.86 16.83,31.37 13.65,31.37 v12,33.02
KILL2  (via drill 0.33)
  Top 0.254: v9.97,27.69 9.72,27.94 9.72,34.54 11.11,35.94 REAR-2.6 | IC1.26 30.16,21.97 29.27,21.97 27.62,23.62 27.62,24.13 26.86,24.89 v26.86,27.69
  Bottom 0.254: v9.97,27.69 v26.86,27.69
KILL3  (via drill 0.33)
  Top 0.254: v39.43,23.11 39.43,25.4 37.15,27.69 37.15,29.08 37.91,29.85 39.05,29.85 39.69,30.48 39.69,31.62 42.35,34.29 44.77,34.29 FRONT.4 | IC1.25 30.16,21.21 29.15,21.21 v28.64,21.72
  Bottom 0.254: v28.64,21.72 29.02,22.1 38.42,22.1 v39.43,23.11
LED  (via drill 0.33)
  Top 0.254: v35.75,17.53 38.04,15.24 WHT-CURRLIM.2 | v19.62,17.65 20.38,17.65 IC1.12
  Bottom 0.254: v35.75,17.53 19.75,17.53 v19.62,17.65
MISO  (via drill 0.33)
  Top 0.254: v18.48,15.49 18.48,19.3 18.61,19.43 IC1.11 | v38.67,16.51 42.23,20.07 42.23,26.67 41.59,27.31 40.32,27.31 39.69,27.94 39.69,29.21 40.96,30.48 J1.1
  Bottom 0.254: v18.48,15.49 20.26,14.61 36.77,14.61 v38.67,16.51
MOSI  (via drill 0.33)
  Top 0.254: v17.34,20.19 18.61,20.19 IC1.10 | v41.21,23.11 41.21,25.65 41.15,25.72 | 41.15,25.72 38.42,28.45 J1.4 | v55.94,25.53 56.83,25.53 IC3.4 | v41.34,25.78 41.21,25.78 41.15,25.72
  Bottom 0.254: v17.34,20.19 18.22,21.08 39.18,21.08 v41.21,23.11 | v55.94,25.53 55.69,25.78 v41.34,25.78
N$1  (via drill 0.33)
  Top 0.254: v17.84,33.66 18.35,33.15 18.35,32.39 R3.1 | 1.59,42.93 USBPWR.A 3.24,41.31 v3.24,38.99
  Bottom 0.254: v3.24,38.99 8.57,33.66 v17.84,33.66
N$2
  Top 0.254: CN1.D+ 9.33,22.22 10.35,21.21 10.35,20.7 10.73,20.32 R2.1
N$3  (via drill 0.33)
  Top 0.254: v13.91,22.86 R1.2 | v17.34,25.4 17.97,26.04 18.61,26.04 18.61,25.91 IC1.3
  Bottom 0.254: v13.91,22.86 16.45,25.4 v17.34,25.4
N$4  (via drill 0.33)
  Top 0.254: v16.07,23.62 12.76,20.32 R2.2 | v17.34,24.51 17.97,25.15 18.61,25.15 IC1.4
  Bottom 0.254: v16.07,23.62 16.95,24.51 v17.34,24.51
N$5
  Top 0.254: R1.1 8.19,22.86 CN1.D-
N$6
  Top 0.254: 1.59,36.32 SPARE.A 3.24,34.76 3.24,29.21 B-CURRLIM.1
N$7  (via drill 0.33)
  Top 0.254: v2.6,30.86 1.59,31.88 INDIC1.A | v12.26,31.37 13.27,32.39 G-CURRLIM.1
  Bottom 0.254: v2.6,30.86 3.11,31.37 v12.26,31.37
N$8  (via drill 0.33)
  Top 0.254: C2.1 35.12,20.95 X3.P$2 | v24.57,19.05 24.57,17.91 24.45,17.78 IC1.17 | 34.73,20.83 35.12,20.83 X3.P$2 | v32.83,19.56 33.59,19.56 34.61,20.57 34.83,20.57 X3.P$2
  Bottom 0.254: v24.57,19.05 25.08,19.56 v32.83,19.56
N$9  (via drill 0.33)
  Top 0.254: 35.12,24.76 C3.1 | v23.56,19.05 23.56,17.78 IC1.16 | v32.83,20.45 32.96,20.57 32.96,22.1 35.12,24.26 35.12,24.76 | 35.12,24.76 X3.P$1
  Bottom 0.254: v23.56,19.05 24.96,20.45 v32.83,20.45
N$10
  Top 0.254: B-CURRLIM1.1 5.27,11.03 5.27,7.62 4,6.35 MS-TX.A
N$11
  Top 0.254: MS-RX.A 3.91,13.19 R-CURRLIM1.1
N$12
  Top 0.254: B-CURRLIM3.1 58.48,15.24 58.48,14.99 61.79,11.68 61.79,7.49 63.82,5.46 70.77,5.46 BT-TX.A
N$13  (via drill 0.33)
  Top 0.254: v59.25,29.21 59.12,29.34 59.12,30.48 R-CURRLIM2.1 | v70.42,11.3 70.42,9.49 BT-RX.A
  Bottom 0.254: v59.25,29.21 70.42,18.03 v70.42,11.3
N$14  (via drill 0.33)
  Top 0.61: Q1.2 69.72,25.21 v68.9,26.04 | IC2.1 56.2,41.91 C13.+
  Bottom 0.508: 68.26,27.94 68.26,27.81
  Bottom 0.61: C13.+ 59.37,36.19 66.48,36.19 68.26,34.42 68.26,27.94 68.26,26.67 v68.9,26.04
N$25  (via drill 0.33)
  Top 0.254: v44.01,11.81 42.99,12.83 42.99,14.86 42.61,15.24 WHT-CURRLIM.1 | v68.01,12.57 69.11,12.57 READY.A
  Bottom 0.254: v44.01,11.81 44.39,12.19 50.74,12.19 51.12,12.57 v68.01,12.57
N$48  (via drill 0.33)
  Top 0.254: v56.2,28.96 56.2,29.85 56.45,30.1 C9.1 | U1.1 53.02,26.67 53.53,27.18 v53.53,27.69
  Bottom 0.254: v56.2,28.96 54.93,27.69 v53.53,27.69
N$49  (via drill 0.33)
  Top 0.254: v54.42,28.96 54.42,29.97 54.55,30.1 C9.2 | v50.74,27.69 50.48,27.43 U1.3
  Bottom 0.254: v54.42,28.96 53.78,28.32 51.37,28.32 v50.74,27.69
N$50
  Top 0.254: U1.4 49.21,27.57 C10.1
N$51
  Top 0.254: U1.5 47.94,28.31 C10.2
N$52
  Top 0.254: U1.2 51.75,25.65 47.31,21.21 47.31,17.65 46.67,17.02 46.67,15.49 46.42,15.24 C11.1
N$53
  Top 0.254: C12.1 46.93,30.48 46.8,30.35 46.8,26.42 46.67,26.29 U1.6
PITOT
  Top 0.254: IC1.41 22.8,29.34 22.8,30.23 21.27,31.75 21.27,33.15 19.37,35.05 19.37,35.69 17.59,37.47 16.19,37.47 REAR-2.3
RST  (via drill 0.33)
  Top 0.254: v60.26,15.49 61.91,15.49 RST.P$2 | v28.51,12.7 28.51,13.84 R6.2 28.51,13.97 26.86,12.32 22.03,12.32 21.27,13.08 21.27,17.67 IC1.13 | v42.23,29.85 42.74,29.34 42.74,17.65 44.01,16.38 v44.01,12.7
  Bottom 0.254: v60.26,15.49 57.85,13.08 50.48,13.08 50.1,12.7 v44.01,12.7 v28.51,12.7 | J1.5 37.15,29.85 v42.23,29.85
SCK  (via drill 0.33)
  Top 0.254: v17.34,21.08 18.61,21.08 IC1.9 | v57.98,27.18 57.98,25.65 58.1,25.53 IC3.3
  Bottom 0.254: v17.34,21.08 21.91,25.65 27.75,25.65 28.77,26.67 29.65,26.67 30.61,27.62 | 30.61,27.62 35.5,32.51 37.02,32.51 J1.3 | v57.98,27.18 57.59,26.8 40.2,26.8 39.31,25.91 32.32,25.91 30.61,27.62
SERVO
  Top 0.254: REAR-1.3 31.43,25.4 31.18,25.15 30.29,25.15 IC1.30
SLCD  (via drill 0.33)
  Top 0.254: v28.89,27.31 28.89,26.8 30.16,26.8 IC1.32
  Bottom 0.254: v28.89,27.31 29.4,27.81 30.04,27.81 35.62,33.4 37.53,33.4 40.2,36.07 41.47,36.07 FRONT.8
SPARE-1  (via drill 0.33)
  Top 0.254: v6.16,30.23 B-CURRLIM.2 | v29.65,29.21 30.16,28.7 30.16,27.56 IC1.33 | FRONT.3 46.67,40 39.18,40 33.85,34.67 v33.85,32.51 | v62.04,37.59 62.04,35.05 5PH.3
  Bottom 0.254: FRONT.3 47.94,40.13 48.96,41.15 59.5,41.15 62.04,38.61 v62.04,37.59 | v33.85,32.51 33.21,31.88 32.32,31.88 v29.65,29.21 16.83,29.21 15.81,30.23 v6.16,30.23
SPARE-2  (via drill 0.33)
  Top 0.254: IC1.8 17.41,21.89 16.7,22.61 16.7,31.37 17.08,31.75 17.08,33.78 v18.73,35.43
  Bottom 0.254: v18.73,35.43 19.75,34.42 36,34.42 42.1,40.51 43.88,40.51 45.4,38.99 FRONT.5 46.16,38.73 47.43,37.47 50.61,37.47 51.12,36.96 57.47,36.96 58.86,35.56 62.55,35.56 5PH.4
SPARE-3  (via drill 0.33)
  Top 0.254: IC1.22 28.51,17.78 29.27,17.78 v29.65,18.16 | v43.5,27.69 v43.5,23.62
  Bottom 0.254: v43.5,27.69 47.69,31.88 64.2,31.88 66.36,34.04 5PH.5 | v29.65,18.16 39.05,18.16 43.5,22.61 v43.5,23.62
SQUIRT-P2  (via drill 0.33)
  Top 0.254: 49.09,19.68 U1.13 49.21,14.1 48.83,13.72 v48.83,13.34 | MEGASQUIRT.4 18.61,10.29 18.86,10.29 21.15,8 21.15,6.6 22.29,5.46 43.24,5.46 45.28,7.49 v45.28,13.97
  Bottom 0.254: v45.28,13.97 48.2,13.97 v48.83,13.34
SQUIRT-P3  (via drill 0.33)
  Top 0.254: U1.14 50.48,14.35 51.37,13.46 v51.37,11.94
  Bottom 0.254: v51.37,11.94 50.99,11.56 44.64,11.56 44.26,11.18 43.75,11.18 42.86,12.07 23.05,12.07 21.4,10.41 21.27,10.41 MEGASQUIRT.3
SQUIRT-RX  (via drill 0.33)
  Top 0.254: v6.29,13.97 R-CURRLIM1.2 | v26.35,16.38 26.86,16.89 26.86,17.65 IC1.20 | v44.13,22.35 v46.93,22.35 | v48.2,21.08 47.94,20.83 U1.12
  Bottom 0.254: v6.29,13.97 9.33,17.02 25.72,17.02 v26.35,16.38 26.86,16.89 37.27,16.89 37.53,17.14 42.35,17.14 43.12,17.91 43.12,21.46 v44.13,22.35 | v46.93,22.35 v48.2,21.08
SQUIRT-TX  (via drill 0.33)
  Top 0.254: v11.75,13.97 B-CURRLIM1.2 | v26.73,13.97 27.11,14.35 27.11,15.75 27.75,16.38 27.75,17.65 IC1.21 | v43.88,17.4 43.37,17.91 43.37,20.95 44.13,21.72 46.16,21.72 46.67,21.21 U1.11
  Bottom 0.254: v11.75,13.97 v26.73,13.97 40.45,13.97 v43.88,17.4
THROT-IN
  Top 0.254: REAR-1.7 26.35,38.48 24.83,38.48 22.03,35.69 22.03,32.13 23.05,31.11 23.81,31.11 24.45,30.48 IC1.39
UCAP  (via drill 0.33)
  Top 0.254: v16.32,21.84 16.32,21.34 12.76,17.78 C1.1 | v17.34,22.86 17.97,23.5 IC1.6
  Bottom 0.254: v17.34,22.86 v16.32,21.84
VBAT1  (via drill 0.33)
  Top 0.254: v52.39,35.43 52.39,40.13 50.23,42.29 26.99,42.29 25.34,40.64 14.92,40.64 13.65,39.37 REAR-2.4 | R9.2 65.34,30.48 65.34,31.5 64.33,32.51 v63.31,32.51
  Bottom 0.254: v63.31,32.51 63.18,32.39 55.44,32.39 v52.39,35.43
VBAT1MON  (via drill 0.33)
  Top 0.254: 63.44,26.67 63.44,30.48 R9.1 | v26.1,23.88 23.56,26.42 23.56,29.21 IC1.40 | v62.67,24.76 63.44,25.53 63.44,26.67 | 63.44,26.67 R7.2
  Bottom 0.254: v26.1,23.88 27.37,22.61 37.4,22.61 39.18,24.38 44.13,24.38 45.28,23.24 45.28,18.67 48.07,15.88 55.69,15.88 62.67,22.86 v62.67,24.76
VBAT2  (via drill 0.33)
  Top 0.254: v65.47,37.72 68.14,35.05 68.14,21.72 R10.2 | v42.23,41.66 29.27,41.66 27.62,40 REAR-1.6
  Bottom 0.254: v65.47,37.72 63.69,37.72 59.75,41.66 v42.23,41.66
VBAT2MON  (via drill 0.33)
  Top 0.254: R8.2 63.44,22.86 63.44,19.05 R10.1 63.56,19.05 63.56,17.78 63.94,17.4 v63.94,10.41 | v29.02,18.92 26.86,21.08 26.86,24 26.1,24.76 26.1,29.21 IC1.37 | v33.46,18.8 38.29,13.97 v38.29,7.49
  Bottom 0.254: v29.02,18.92 29.15,18.8 v33.46,18.8 | v38.29,7.49 40.32,5.46 58.99,5.46 v63.94,10.41
VBUS
  Top 0.254: L1.1 10.96,25.76 9.08,23.88 8.24,23.88 CN1.VBUS
VCC  (via drill 0.33)  (1 unrouted)
  Top 0.508: v25.46,15.24 25.46,13.97 C6.1 | IC1.14 22.03,17.65 22.03,15.88 v21.91,15.75 | 32.07,20.19 30.29,20.19 IC1.24 | 32.07,20.19 32.07,17.27 v30.04,15.24 30.42,14.86 30.42,13.97 R6.1 30.54,13.84 30.54,11.18 26.86,7.49 25.45,7.49 MEGASQUIRT.6 | v23.43,33.66 23.43,32.39 R4.2 | v27.37,32.51 28.38,32.51 R5.1 28.45,32.31 IC1.34 | REAR-1.2 32.32,35.81 32.32,34.04 v32.07,33.78 32.07,26.92 | 32.07,26.92 32.07,20.19 | v48.32,16.51 48.32,15.24 C11.2 48.32,15.11 48.32,13.97 46.8,12.45 46.8,8 49.34,5.46 56.45,5.46 58.36,7.37 BLUETOOTH.6 | C7.1 53.28,15.24 53.28,16.13 v52.9,16.51 53.02,16.64 U1.16 v53.02,21.46 | IC2.3 64.71,45.34 64.71,41.28 | 64.71,41.28 69.53,41.28 EXPAND.2 74.61,36.19 74.61,17.78 JP1.1 | v60.01,23.88 60.64,24.51 IC3.1 60.64,28.96 60.01,29.59 60.01,31.37 58.74,32.64 5PH.2 61.28,36.83 61.28,37.97 62.67,39.37 C14.+ 64.71,40.26 64.71,41.28 | v32.19,26.92 32.07,26.92
  Top 0.61: v19.62,30.1 20.13,30.1 20.38,29.85
  Bottom 0.508: v30.04,15.24 v25.46,15.24 22.42,15.24 v21.91,15.75 | v23.43,33.66 23.3,33.78 19.24,33.78 16.83,36.19 REAR-2.2 | v19.62,30.1 23.18,33.66 v23.43,33.66 | v23.43,33.66 23.56,33.53 26.35,33.53 v27.37,32.51 28.64,33.78 v32.07,33.78 | v52.9,16.51 v48.32,16.51 | 5PH.2 58.74,34.8 57.21,36.32 49.34,36.32 FRONT.2 49.21,35.69 42.61,29.08 41.47,29.08 J1.2 41.08,28.45 39.18,26.54 32.58,26.54 v32.19,26.92 | v60.01,23.88 57.59,21.46 v53.02,21.46
VIN
  Top 0.61: Q1.3 71.84,26.9 70.8,27.94 70.8,31.44 VBATT.2
VOUT-1  (via drill 0.33)
  Top 0.254: v47.43,41.02 49.21,39.24 49.21,37.72 49.47,37.47 50.1,37.47 50.61,36.96 50.61,36.07 55.56,31.24 55.56,28.7 57.47,26.67 57.47,24.13 58.1,23.5 58.99,23.5 60.52,21.97 60.52,20.45 60.64,20.32 IC3.8
  Bottom 0.254: v47.43,41.02 41.34,41.02 40.96,40.64 30.54,40.64 28.89,38.99 REAR-1.5
VOUT-2  (via drill 0.33)
  Top 0.254: v41.85,32.77 51.5,32.77 53.02,31.24 53.02,29.21 54.29,27.94 54.29,25.65 57.98,21.97 57.98,20.45 58.1,20.32 IC3.6 | v36.51,35.81 v38.67,33.66
  Bottom 0.254: v41.85,32.77 40.96,33.66 v38.67,33.66 | v36.51,35.81 35.62,34.92 32.19,34.92 30.92,36.19 REAR-1.4
WHEEL-IN  (via drill 0.33)
  Top 0.254: v7.05,28.19 6.92,28.32 6.92,37.72 7.94,38.73 REAR-2.7 | IC1.19 25.97,17.78 25.97,18.54 v24.07,20.45
  Bottom 0.254: v24.07,20.45 23.18,19.56 15.68,19.56 v7.05,28.19

### Text on the board
tPlace: USB | CONN3 | CONN2 | CONN1 | EXP | 1WIRE | 5v | ICSP | +VIN- | RESET | OK | rx | rx | tx | tx | RS232-1 | RS232-2